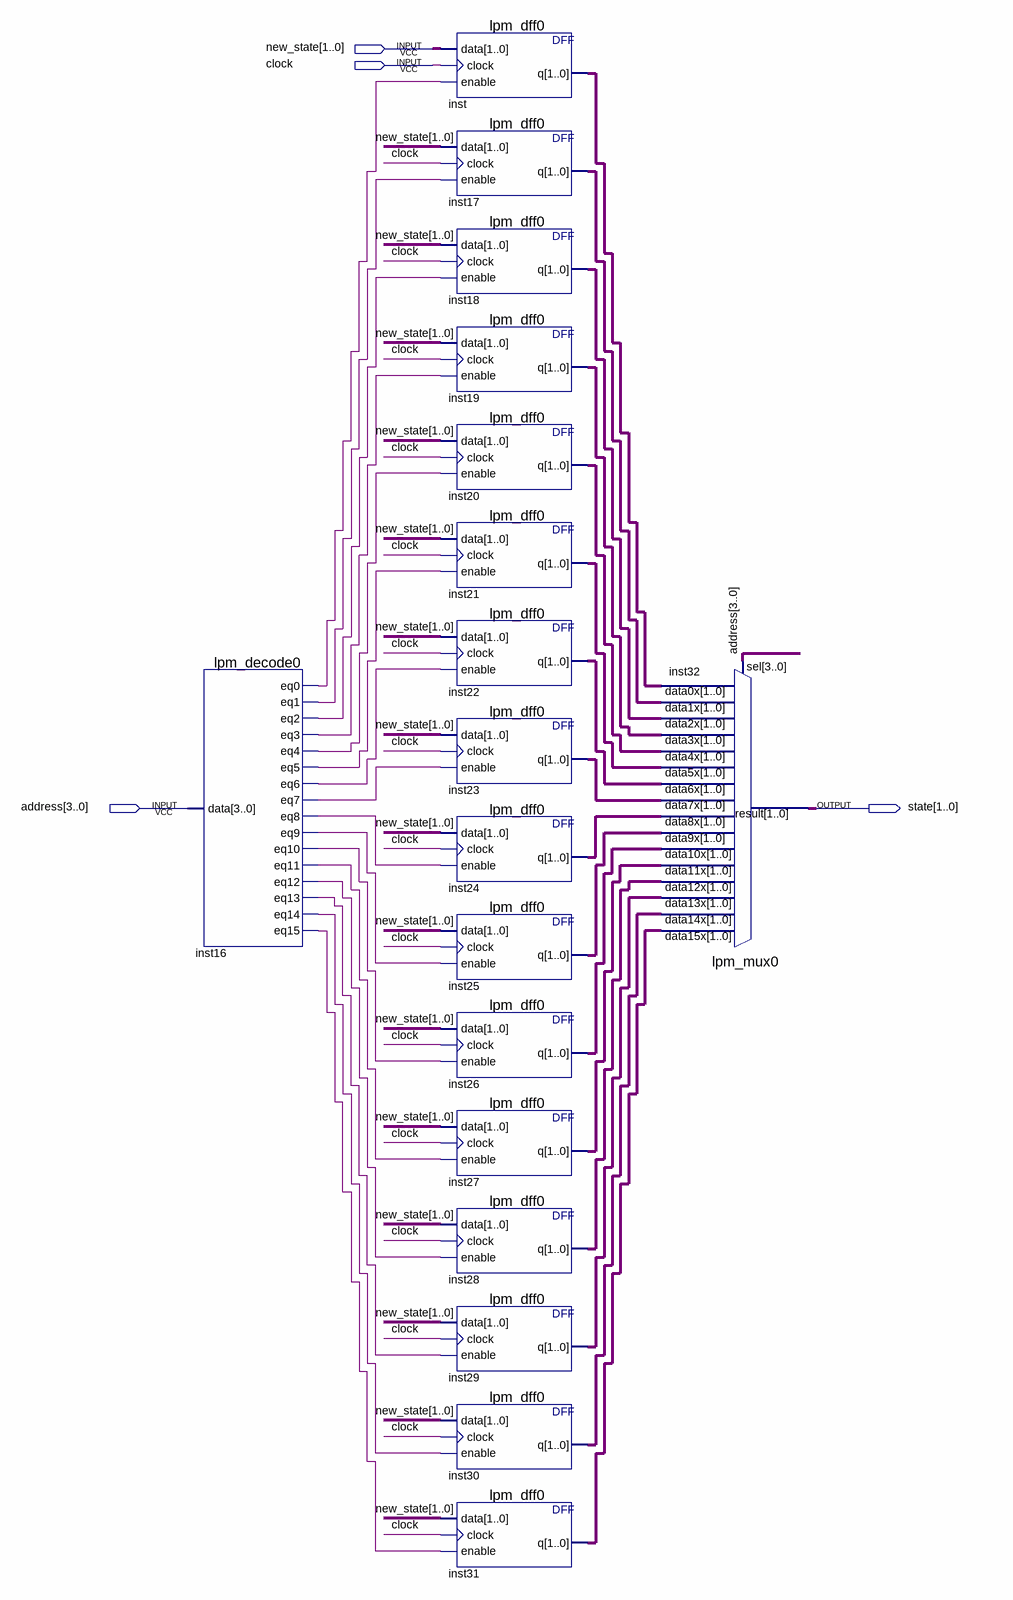
[diagram p0: schematic sheet]
// Quartus schematic PHT.bdf as structural Verilog: 18 symbols, 4 pins
module PHT (
  input  [1:0] new_state,
  input  clock,
  input  [3:0] address,
  output [1:0] state
);

  wire inst16_eq0, inst16_eq1, inst16_eq2, inst16_eq3, inst16_eq4, inst16_eq5, inst16_eq6, inst16_eq7,
       inst16_eq8, inst16_eq9, inst16_eq10, inst16_eq11, inst16_eq12, inst16_eq13, inst16_eq14, inst16_eq15;
  wire [1:0] inst17_q, inst18_q, inst19_q, inst20_q, inst21_q, inst22_q, inst23_q, inst24_q, inst25_q,
       inst26_q, inst27_q, inst28_q, inst29_q, inst30_q, inst31_q, inst_q;

  lpm_decode0 inst16 (
    .data(address), .eq0(inst16_eq0), .eq1(inst16_eq1), .eq2(inst16_eq2), .eq3(inst16_eq3), .eq4(inst16_eq4),
    .eq5(inst16_eq5), .eq6(inst16_eq6), .eq7(inst16_eq7), .eq8(inst16_eq8), .eq9(inst16_eq9),
    .eq10(inst16_eq10), .eq11(inst16_eq11), .eq12(inst16_eq12), .eq13(inst16_eq13), .eq14(inst16_eq14),
    .eq15(inst16_eq15));
  lpm_dff0 inst (.data(new_state), .clock(clock), .enable(inst16_eq0), .q(inst_q));
  lpm_dff0 inst17 (.data(new_state), .clock(clock), .enable(inst16_eq1), .q(inst17_q));
  lpm_dff0 inst18 (.data(new_state), .clock(clock), .enable(inst16_eq2), .q(inst18_q));
  lpm_dff0 inst19 (.data(new_state), .clock(clock), .enable(inst16_eq3), .q(inst19_q));
  lpm_dff0 inst20 (.data(new_state), .clock(clock), .enable(inst16_eq4), .q(inst20_q));
  lpm_dff0 inst21 (.data(new_state), .clock(clock), .enable(inst16_eq5), .q(inst21_q));
  lpm_dff0 inst22 (.data(new_state), .clock(clock), .enable(inst16_eq6), .q(inst22_q));
  lpm_dff0 inst23 (.data(new_state), .clock(clock), .enable(inst16_eq7), .q(inst23_q));
  lpm_dff0 inst24 (.data(new_state), .clock(clock), .enable(inst16_eq8), .q(inst24_q));
  lpm_dff0 inst25 (.data(new_state), .clock(clock), .enable(inst16_eq9), .q(inst25_q));
  lpm_dff0 inst26 (.data(new_state), .clock(clock), .enable(inst16_eq10), .q(inst26_q));
  lpm_dff0 inst27 (.data(new_state), .clock(clock), .enable(inst16_eq11), .q(inst27_q));
  lpm_dff0 inst28 (.data(new_state), .clock(clock), .enable(inst16_eq12), .q(inst28_q));
  lpm_dff0 inst29 (.data(new_state), .clock(clock), .enable(inst16_eq13), .q(inst29_q));
  lpm_dff0 inst30 (.data(new_state), .clock(clock), .enable(inst16_eq14), .q(inst30_q));
  lpm_dff0 inst31 (.data(new_state), .clock(clock), .enable(inst16_eq15), .q(inst31_q));
  lpm_mux0 inst32 (
    .data15x(inst31_q), .data14x(inst30_q), .data13x(inst29_q), .data12x(inst28_q), .data11x(inst27_q),
    .data10x(inst26_q), .data9x(inst25_q), .data8x(inst24_q), .data7x(inst23_q), .data6x(inst22_q),
    .data5x(inst21_q), .data4x(inst20_q), .data3x(inst19_q), .data2x(inst18_q), .data1x(inst17_q),
    .data0x(inst_q), .sel(address), .result(state));
endmodule
